# EAGLE design QFN-16 0.5mm (EAGLE 8.0.2)
CNAME: QFN-16 0,5mm Breakout; CREVISION: V1.0; DESIGNER: November Five
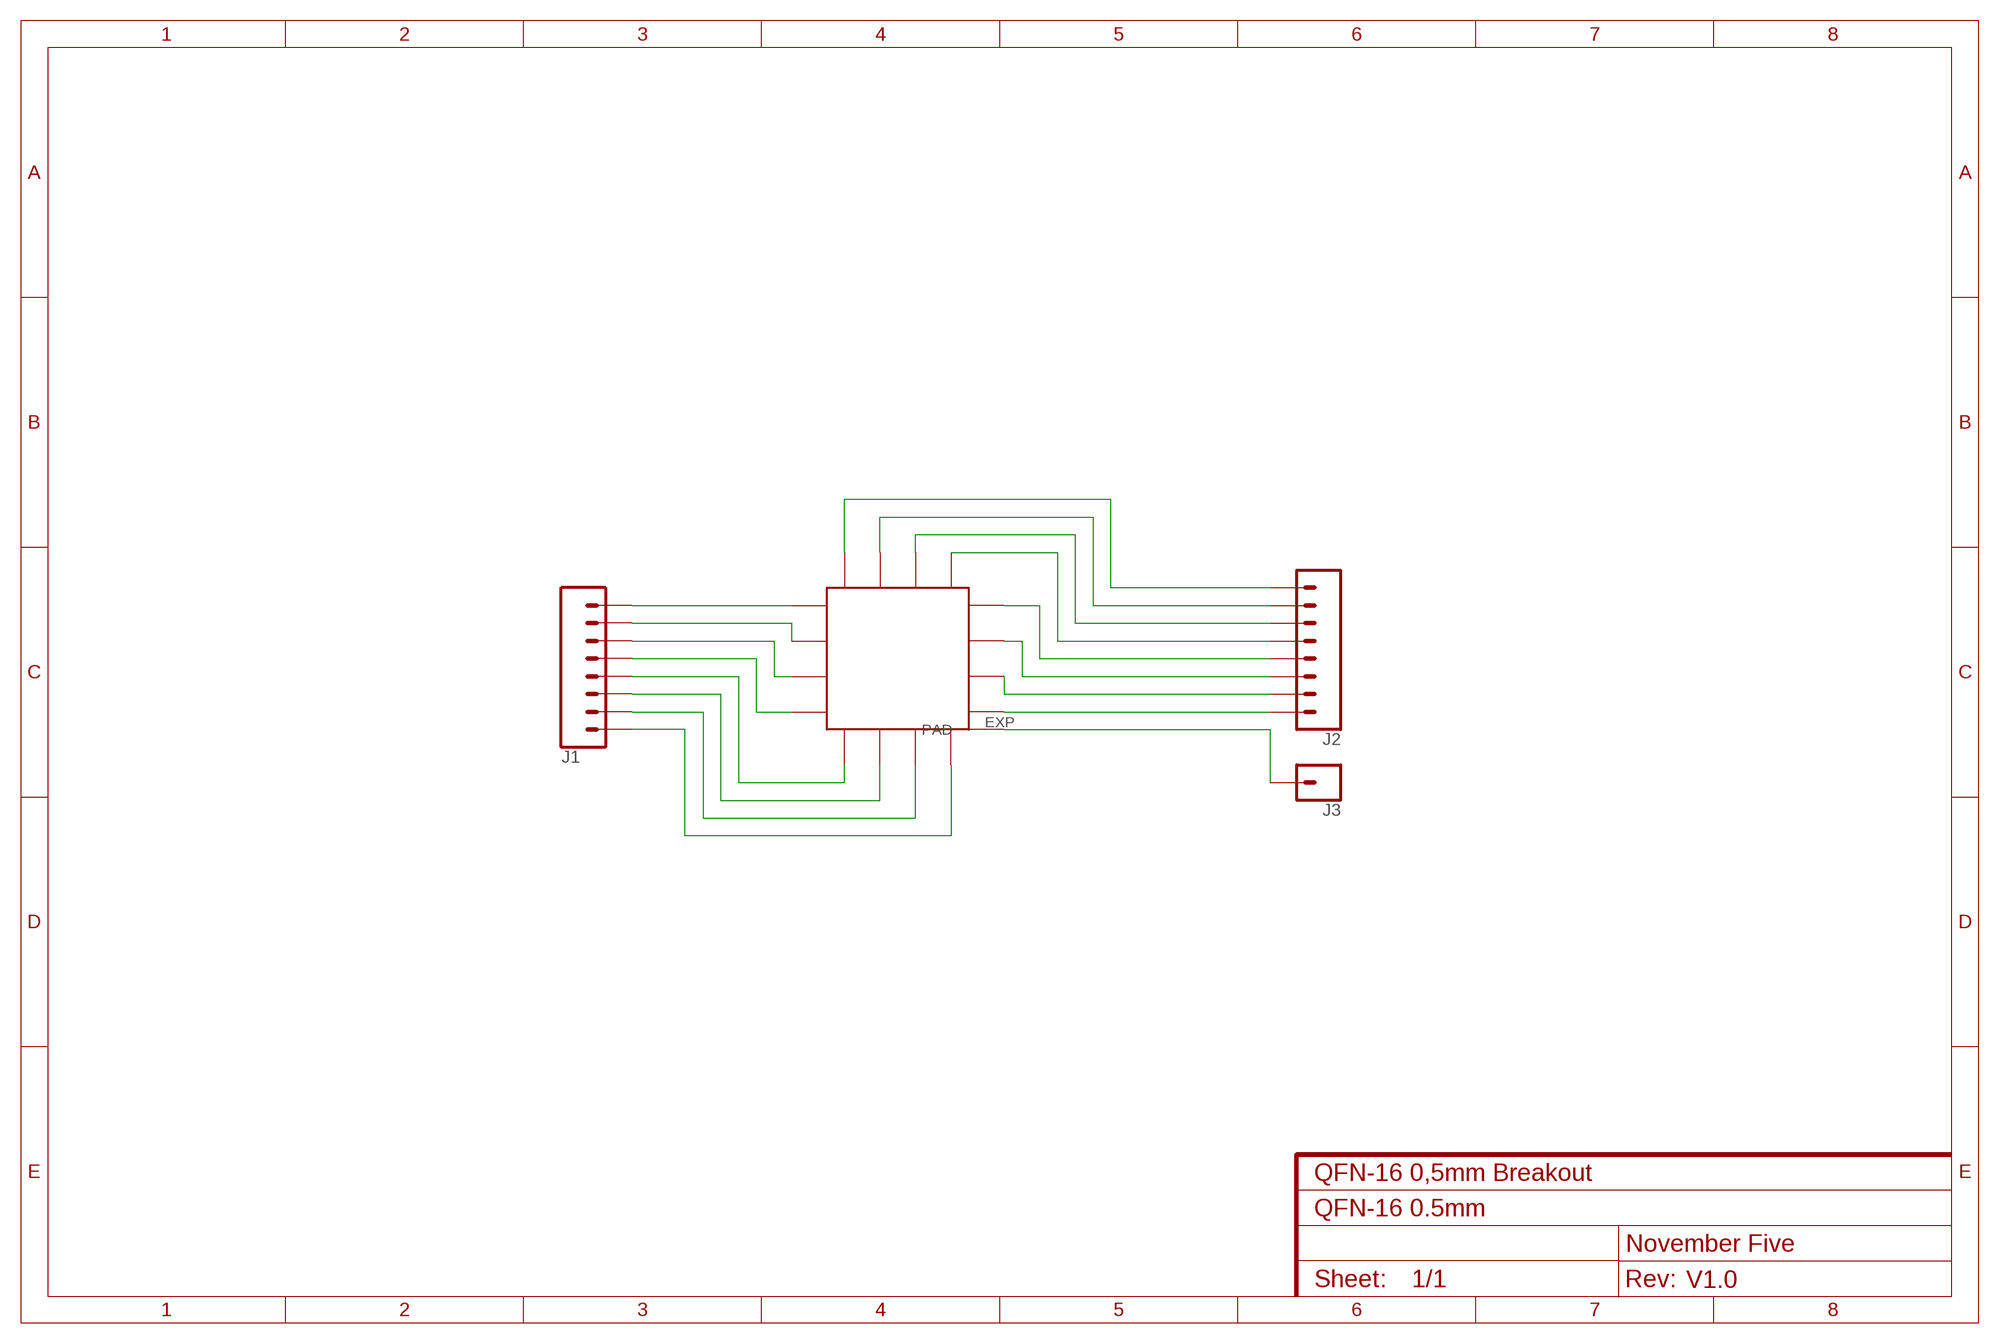
[diagram p0: schematic, sheet 1]

## Parts
J1  CONN_08"  [1X08]
J2  CONN_08"  [1X08]
J3  CONN_01  [1X01]
U$1  QFN-16_0,5MM  [QFN16_0,5MM]

## Nets
N$1: J1.1 U$1.1(PIN1)
N$2: J1.2 U$1.2(PIN2)
N$3: J1.3 U$1.3(PIN3)
N$4: J1.4 U$1.4(PIN4)
N$5: J1.5 U$1.5(PIN5)
N$6: J1.6 U$1.6(PIN6)
N$7: J1.7 U$1.7(PIN7)
N$8: J1.8 U$1.8(PIN8)
N$9: J2.8 U$1.9(PIN9)
N$10: J2.7 U$1.10(PIN10)
N$11: J2.6 U$1.11(PIN11)
N$12: J2.5 U$1.12(PIN12)
N$13: J2.4 U$1.13(PIN13)
N$14: J2.3 U$1.14(PIN14)
N$15: J2.2 U$1.15(PIN15)
N$16: J2.1 U$1.16(PIN16)
N$17: J3.1 U$1.EXP(PAD)

## Library data of the parts
J1 J2 = SparkFun-Connectors:CONN_08: Multi connection point. Often used as Generic Header-pin footprint for 0.1 inch spaced/style header connections On any of the 0.1 inch spaced packages, you can populate with these: Break Away Headers - Straight <https://www.sparkfun.com/products/116> (PRT-00116) Break Away Male Headers - Right Angle <https://www.sparkfun.com/products/553> (PRT-00553) Female Headers <https://www.sparkfun.com/products/115> (PRT-00115) Break Away Headers - Machine Pin <https://www.sparkfun.com/products/117> (PRT-00117) Break Away Female Headers - Swiss Machine Pin <https://www.sparkfun.com/products/743> (PRT-00743) Arduino Stackable Header - 8 Pin <https://www.sparkfun.com/products/9279> (PRT-09279) For SCREWTERMINALS and SPRING TERMINALS visit here: Screw Terimnals on SparkFun.com <https://www.sparkfun.com/search/results?term=Screw+Terminals> (5mm/3.5mm/2.54mm spacing) This device is also useful as a general connection point to wire up your design to another part of your project. Our various solder wires solder well into these plated through hole pads. Hook-Up Wire - Assortment (Stranded, 22 AWG) <https://www.sparkfun.com/products/11375> (PRT-11375) Hook-Up Wire - Assortment (Solid Core, 22 AWG) <https://www.sparkfun.com/products/11367> (PRT-11367) View the entire wire category on our website here <https://www.sparkfun.com/categories/141> Special notes: Molex polarized connector foot print use with SKU : PRT-08231 with associated crimp pins and housings. 1MM SMD Version SKU: PRT-10208 NOTES ON THE VARIANTS LOCK and LOCK_LONGPADS... This footprint was designed to help hold the alignment of a through-hole component (i.e. 6-pin header) while soldering it into place. You may notice that each hole has been shifted either up or down by 0.005 of an inch from it's more standard position (which is a perfectly straight line). This slight alteration caused the pins (the squares in the middle) to touch the edges of the holes. Because they are alternating, it causes a "brace" to hold the component in place. 0.005 has proven to be the perfect amount of "off-center" position when using our standard breakaway headers. Although looks a little odd when you look at the bare footprint, once you have a header in there, the alteration is very hard to notice. Also,if you push a header all the way into place, it is covered up entirely on the bottom side.; PROD_ID: CONN-08438
J3 = SparkFun-Connectors:CONN_01: Single connection point. Often used as Generic Header-pin footprint for 0.1 inch spaced/style header connections On any of the 0.1 inch spaced packages, you can populate with these: Break Away Headers - Straight <https://www.sparkfun.com/products/116> (PRT-00116) Break Away Male Headers - Right Angle <https://www.sparkfun.com/products/553> (PRT-00553) Female Headers <https://www.sparkfun.com/products/115> (PRT-00115) Break Away Headers - Machine Pin <https://www.sparkfun.com/products/117> (PRT-00117) Break Away Female Headers - Swiss Machine Pin <https://www.sparkfun.com/products/743> (PRT-00743) This device is also useful as a general connection point to wire up your design to another part of your project. Our various solder wires solder well into these plated through hole pads. Hook-Up Wire - Assortment (Stranded, 22 AWG) <https://www.sparkfun.com/products/11375> (PRT-11375) Hook-Up Wire - Assortment (Solid Core, 22 AWG) <https://www.sparkfun.com/products/11367> (PRT-11367) View the entire wire category on our website here <https://www.sparkfun.com/categories/141> Special notes: SMTSO-256-ET is a "flush mount" nut for a 4-40 screw. We mostly use this on specialty testbeds; it is a nice way to connect hardware to your PCB at an adjustable hieght. Also note, the SNAP packages are for using a snappable style connector. We sell a baggie of snaps and they are also used on two LilyPad designs: Snap Assortment - 30 pack (male and female) <https://www.sparkfun.com/products/11347> (DEV-11347) LilyPad Arduino SimpleSnap <https://www.sparkfun.com/products/10941> (DEV-10941) LilyPad SimpleSnap Protoboard <https://www.sparkfun.com/products/10940> (DEV-10940)
U$1 = IC-packages_BIG-pack V1.0:QFN-16_0,5MM

## Board
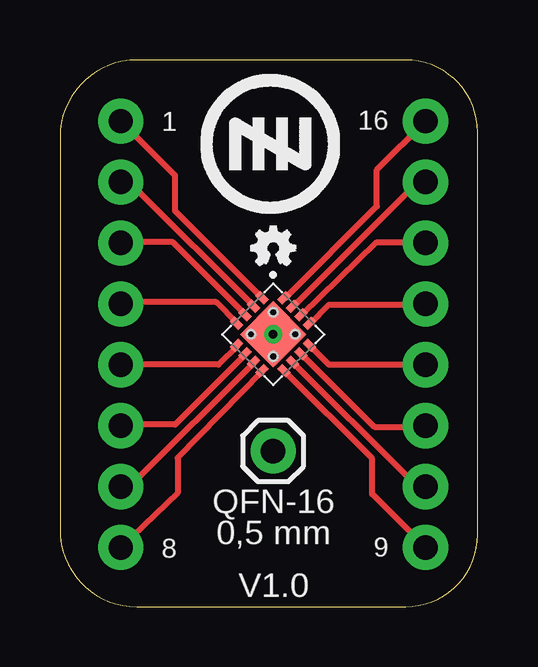
[diagram p1: board, top side]
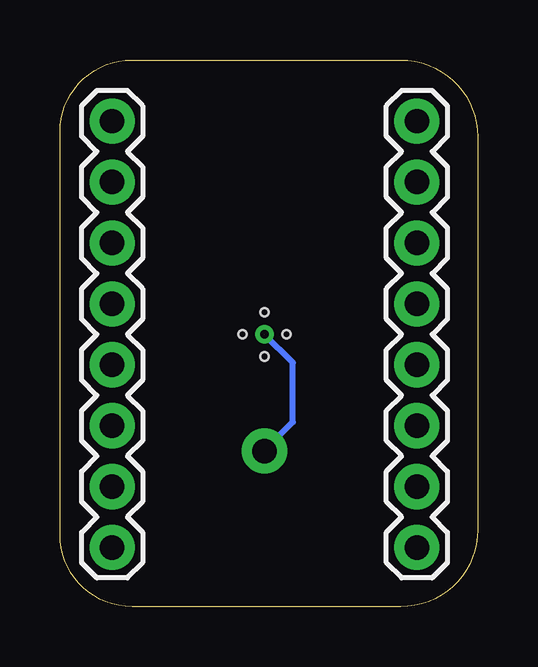
[diagram p2: board, bottom side, seen from below]

Size 17.4 x 22.8 mm. Coordinates in mm from the lower left corner, seen from the top.
Outline: 3.2,22.8 arc90 0,19.6 0,3.2 arc90 3.2,0 14.4,0 arc90 17.4,3 17.4,19.8 arc90 14.4,22.8 3.2,22.8
Copper layers (1*16): Top 0.035mm / dielectric 1.5mm / Bottom 0.035mm
Design rules "default": minimum track width 10mil, minimum drill 24mil, track to track 8mil, track to pad 8mil, pad to pad 8mil, via to via 8mil, smd to smd 8mil, copper to edge 40mil, drill to drill 8mil, minimum pad ring 10mil, minimum via ring 8mil, stop-mask expansion 4mil, vias tented up to drill 0mil, thermal gap 10mil

### Footprints (pad centres in the part's own frame; a part is rotated, then mirrored left to right if it is on the bottom)
1X08 = drill 1.016 pad 1.88: 1 0,0; 2 2.54,0; 3 5.08,0; 4 7.62,0; 5 10.16,0; 6 12.7,0; 7 15.24,0; 8 17.78,0
1X01 = drill 1.016 pad 1.88: 1 0,0
QFN16_0,5MM = smd 0.5 x 0.3: 1 -1.4,0.75; 2 -1.4,0.25; 3 -1.4,-0.25; 4 -1.4,-0.75; 9 1.4,-0.75; 10 1.4,-0.25; 11 1.4,0.25; 12 1.4,0.75 | smd 0.3 x 0.5: 5 -0.75,-1.4; 6 -0.25,-1.4; 7 0.25,-1.4; 8 0.75,-1.4; 13 0.75,1.4; 14 0.25,1.4; 15 -0.25,1.4; 16 -0.75,1.4 | smd 1.95 x 1.95: EXP 0,0 | hole 0.35: -0.65,0.65; 0.65,0.65; -0.65,-0.65; 0.65,-0.65

### Placement (x,y rotation side)
J1  2.53,20.25 270 bottom
J2  15.23,20.25 270 bottom
J3  8.88,6.49 0 top
U$1  8.88,11.36 315 top
U$3  [LOGO-OSHWA]  7.69,14.16 0 top
U$4  [LOGO-NOVEMERFIVE-7SCALE]  6.8,16.4 0 bottom

### Tracks (layer width: path | path; a pad name or v marks a point on that pad's centre or on a via)
GND  (via drill 0.35)
  Bottom 0.254: 8.76,11.16 v8.88,11.36 8.88,11.28
N$1
  Top 0.254: U$1.1 | U$1.1 4.8,16.5 4.8,17.99 J1.1
N$2
  Top 0.254: U$1.2 3.1,17.5 2.74,17.5 J1.2
N$3
  Top 0.254: U$1.3 7.71,12.19 4.7,15.2 2.56,15.2 J1.3
N$4
  Top 0.254: U$1.4 7.36,11.84 6.5,12.7 2.6,12.7 J1.4
N$5
  Top 0.254: U$1.5 7.4,10.9 6.6,10.1 2.72,10.1 J1.5
N$6
  Top 0.254: U$1.6 7.71,10.51 4.8,7.6 2.58,7.6 J1.6
N$7
  Top 0.254: U$1.7 8.07,10.17 3.1,5.2 2.72,5.2 J1.7
N$8
  Top 0.254: U$1.8 8.42,9.82 4.9,6.2 4.9,4.74 J1.8
N$9
  Top 0.254: J2.8 13,4.7 13,6.18 U$1.9
N$10
  Top 0.254: U$1.10 9.71,10.19 14.5,5.4 14.84,5.4 J2.7
N$11
  Top 0.254: U$1.11 13.1,7.5 15.18,7.5 J2.6
N$12
  Top 0.254: U$1.12 | U$1.12 11.2,10.1 J2.5
N$13
  Top 0.254: U$1.13 10.42,11.82 11.2,12.6 15.2,12.6 J2.4
N$14
  Top 0.254: U$1.14 10.07,12.17 13.2,15.2 15.1,15.2 J2.3
N$15
  Top 0.254: U$1.15 9.73,12.53 14.6,17.4 14.92,17.4 J2.2
N$16
  Top 0.254: U$1.16 9.38,12.88 13.2,16.71 13.2,18.22 J2.1
N$17  (1 unrouted)
  Bottom 0.254: J3.1 8.88,6.52 7.7,7.7 7.7,10.18 U$1.EXP

### Text on the board
tPlace: 1 | 16 | QFN-16 | 8 | 0,5 mm | 9 | V1.0